# EAGLE design SSLidarboard (EAGLE 9.5.2)

## Sheet 1 of 2
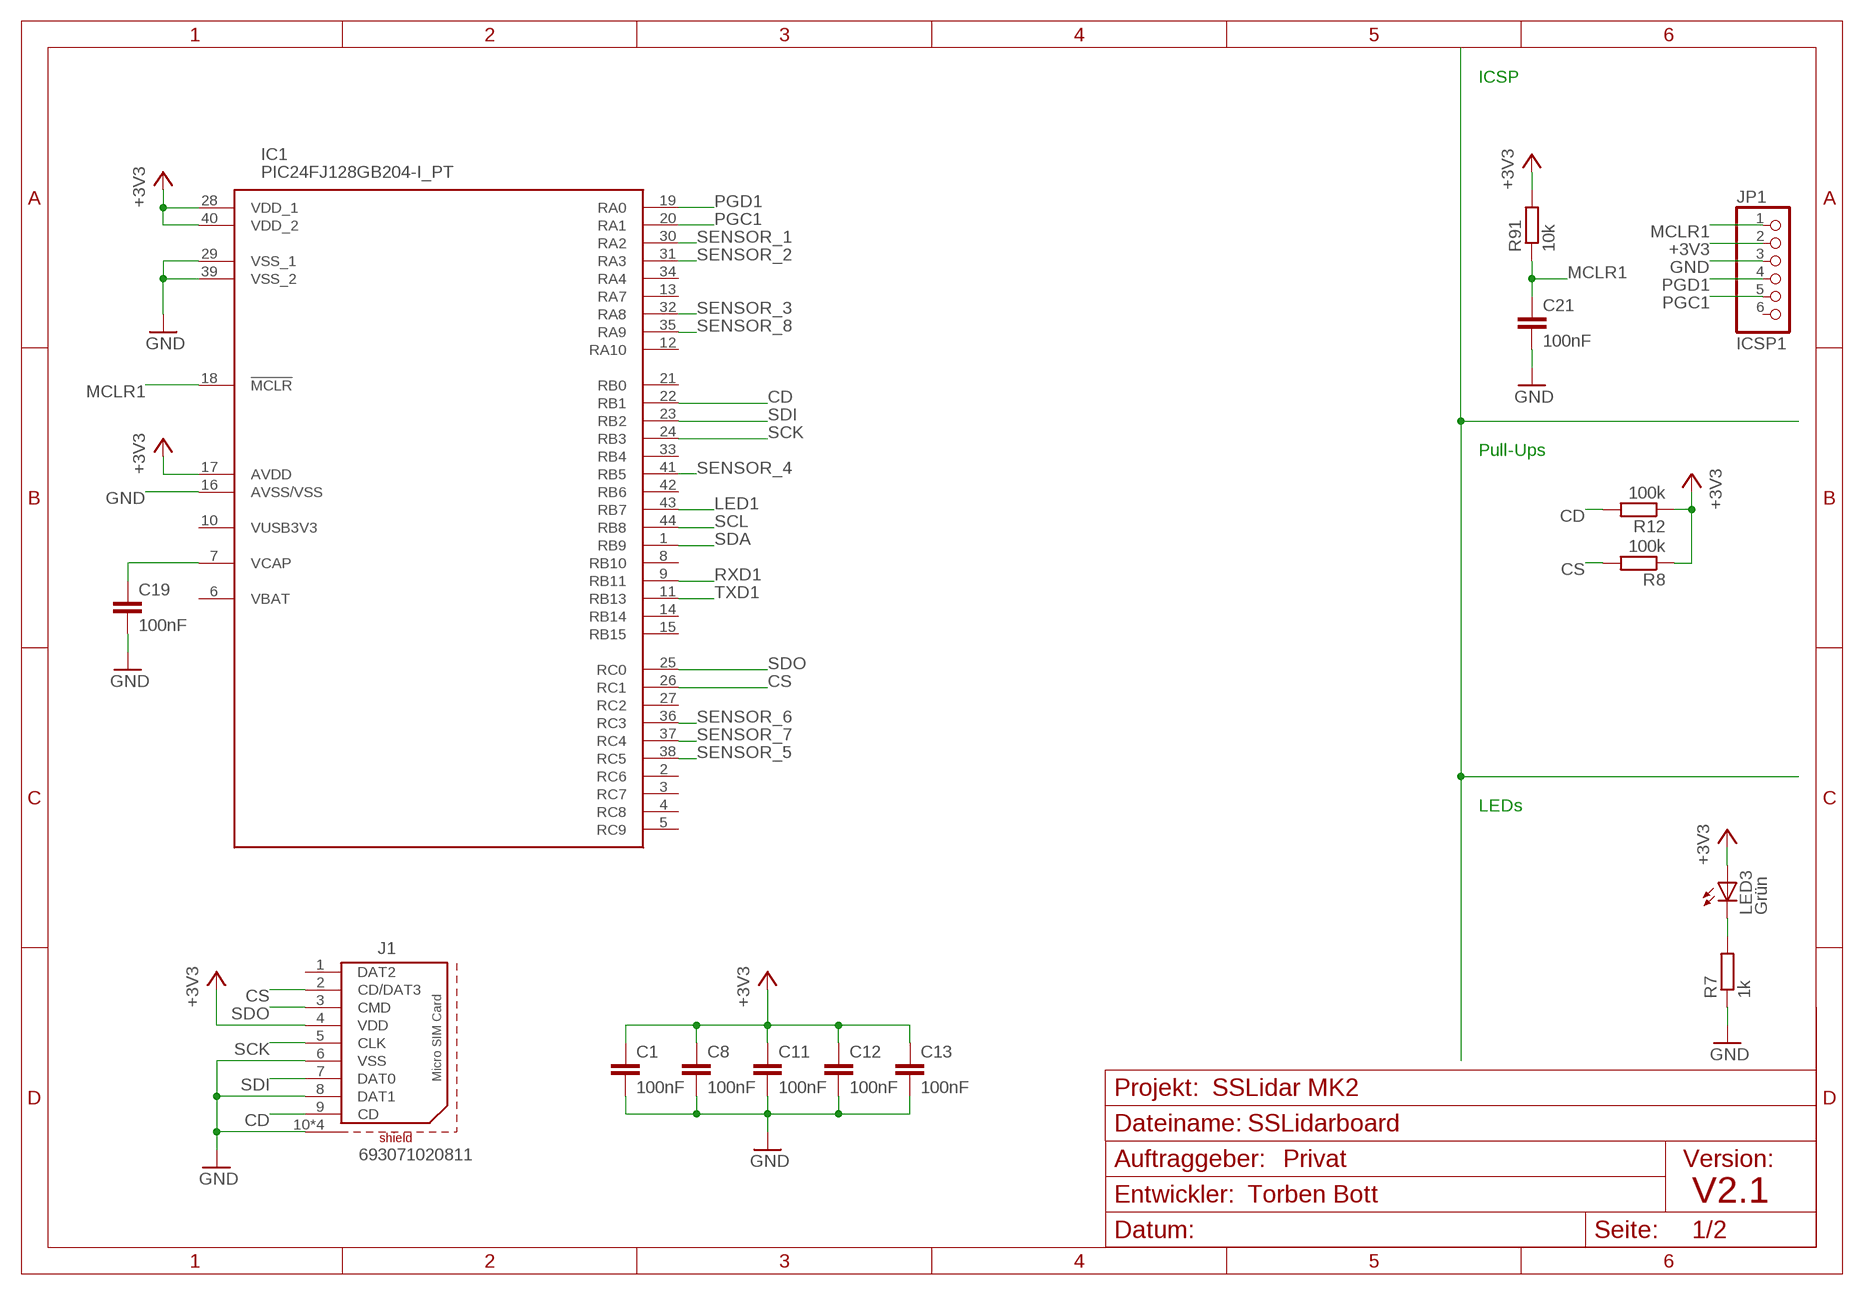
[diagram p0: schematic, sheet 1]

### Parts
C1  100nF  C-EUC0805  [C0805]
C8  100nF  C-EUC0805  [C0805]
C11  100nF  C-EUC0805  [C0805]
C12  100nF  C-EUC0805  [C0805]
C13  100nF  C-EUC0805  [C0805]
C19  100nF  C-EUC0805  [C0805]
C21  100nF  C-EUC0805  [C0805]
IC1  PIC24FJ128GB204-I_PT  [QFP80P1200X1200X120-44N]
J1  693071020811  [693071020811]
JP1  ICSP1  PINHD-1X6  [1X06]
LED3  Grün  LEDCHIPLED_0805  [CHIPLED_0805]
R7  1k  R-EU_R0805  [R0805]
R8  100k  R-EU_R0805  [R0805]
R12  100k  R-EU_R0805  [R0805]
R91  10k  R-EU_R0805  [R0805]

### Nets
+3V3: C1.1 C8.1 C11.1 C12.1 C13.1 IC1.17(AVDD) IC1.28(VDD_1) IC1.40(VDD_2) J1.4(VDD) JP1.2 LED3.A R8.1 R12.1 R91.2 ; also sheet 2
CD: IC1.22(RB1) J1.9(CD) R12.2
CS: IC1.26(RC1) J1.2(CD/DAT3) R8.2
GND: C1.2 C8.2 C11.2 C12.2 C13.2 C19.2 C21.2 IC1.16(AVSS/VSS) IC1.29(VSS_1) IC1.39(VSS_2) J1.6(VSS) J1.8(DAT1) J1.10(SHIELD) J1.11(SHIELD) J1.12(SHIELD) J1.13(SHIELD) JP1.3 R7.1 ; also sheet 2
LED1: IC1.43(RB7)
MCLR1: C21.1 IC1.18(!MCLR) JP1.1 R91.1
N$14: LED3.C R7.2
N$20: C19.1 IC1.7(VCAP)
PGC1: IC1.20(RA1) JP1.5
PGD1: IC1.19(RA0) JP1.4
RXD1: IC1.9(RB11) ; also sheet 2
SCK: IC1.24(RB3) J1.5(CLK)
SCL: IC1.44(RB8) ; also sheet 2
SDA: IC1.1(RB9) ; also sheet 2
SDI: IC1.23(RB2) J1.7(DAT0)
SDO: IC1.25(RC0) J1.3(CMD)
SENSOR_1: IC1.30(RA2) ; also sheet 2
SENSOR_2: IC1.31(RA3) ; also sheet 2
SENSOR_3: IC1.32(RA8) ; also sheet 2
SENSOR_4: IC1.41(RB5) ; also sheet 2
SENSOR_5: IC1.38(RC5) ; also sheet 2
SENSOR_6: IC1.36(RC3) ; also sheet 2
SENSOR_7: IC1.37(RC4) ; also sheet 2
SENSOR_8: IC1.35(RA9) ; also sheet 2
TXD1: IC1.11(RB13) ; also sheet 2
Unconnected: IC1.2(RC6) IC1.3(RC7) IC1.4(RC8) IC1.5(RC9) IC1.6(VBAT) IC1.8(RB10) IC1.10(VUSB3V3) IC1.12(RA10) IC1.13(RA7) IC1.14(RB14) IC1.15(RB15) IC1.21(RB0) IC1.27(RC2) IC1.33(RB4) IC1.34(RA4) IC1.42(RB6) J1.1(DAT2) JP1.6

### Notes on the sheet
- ICSP
- Pull-Ups
- LEDs
- SSLidar MK2
- Privat
- Torben Bott | V2.1

## Sheet 2 of 2
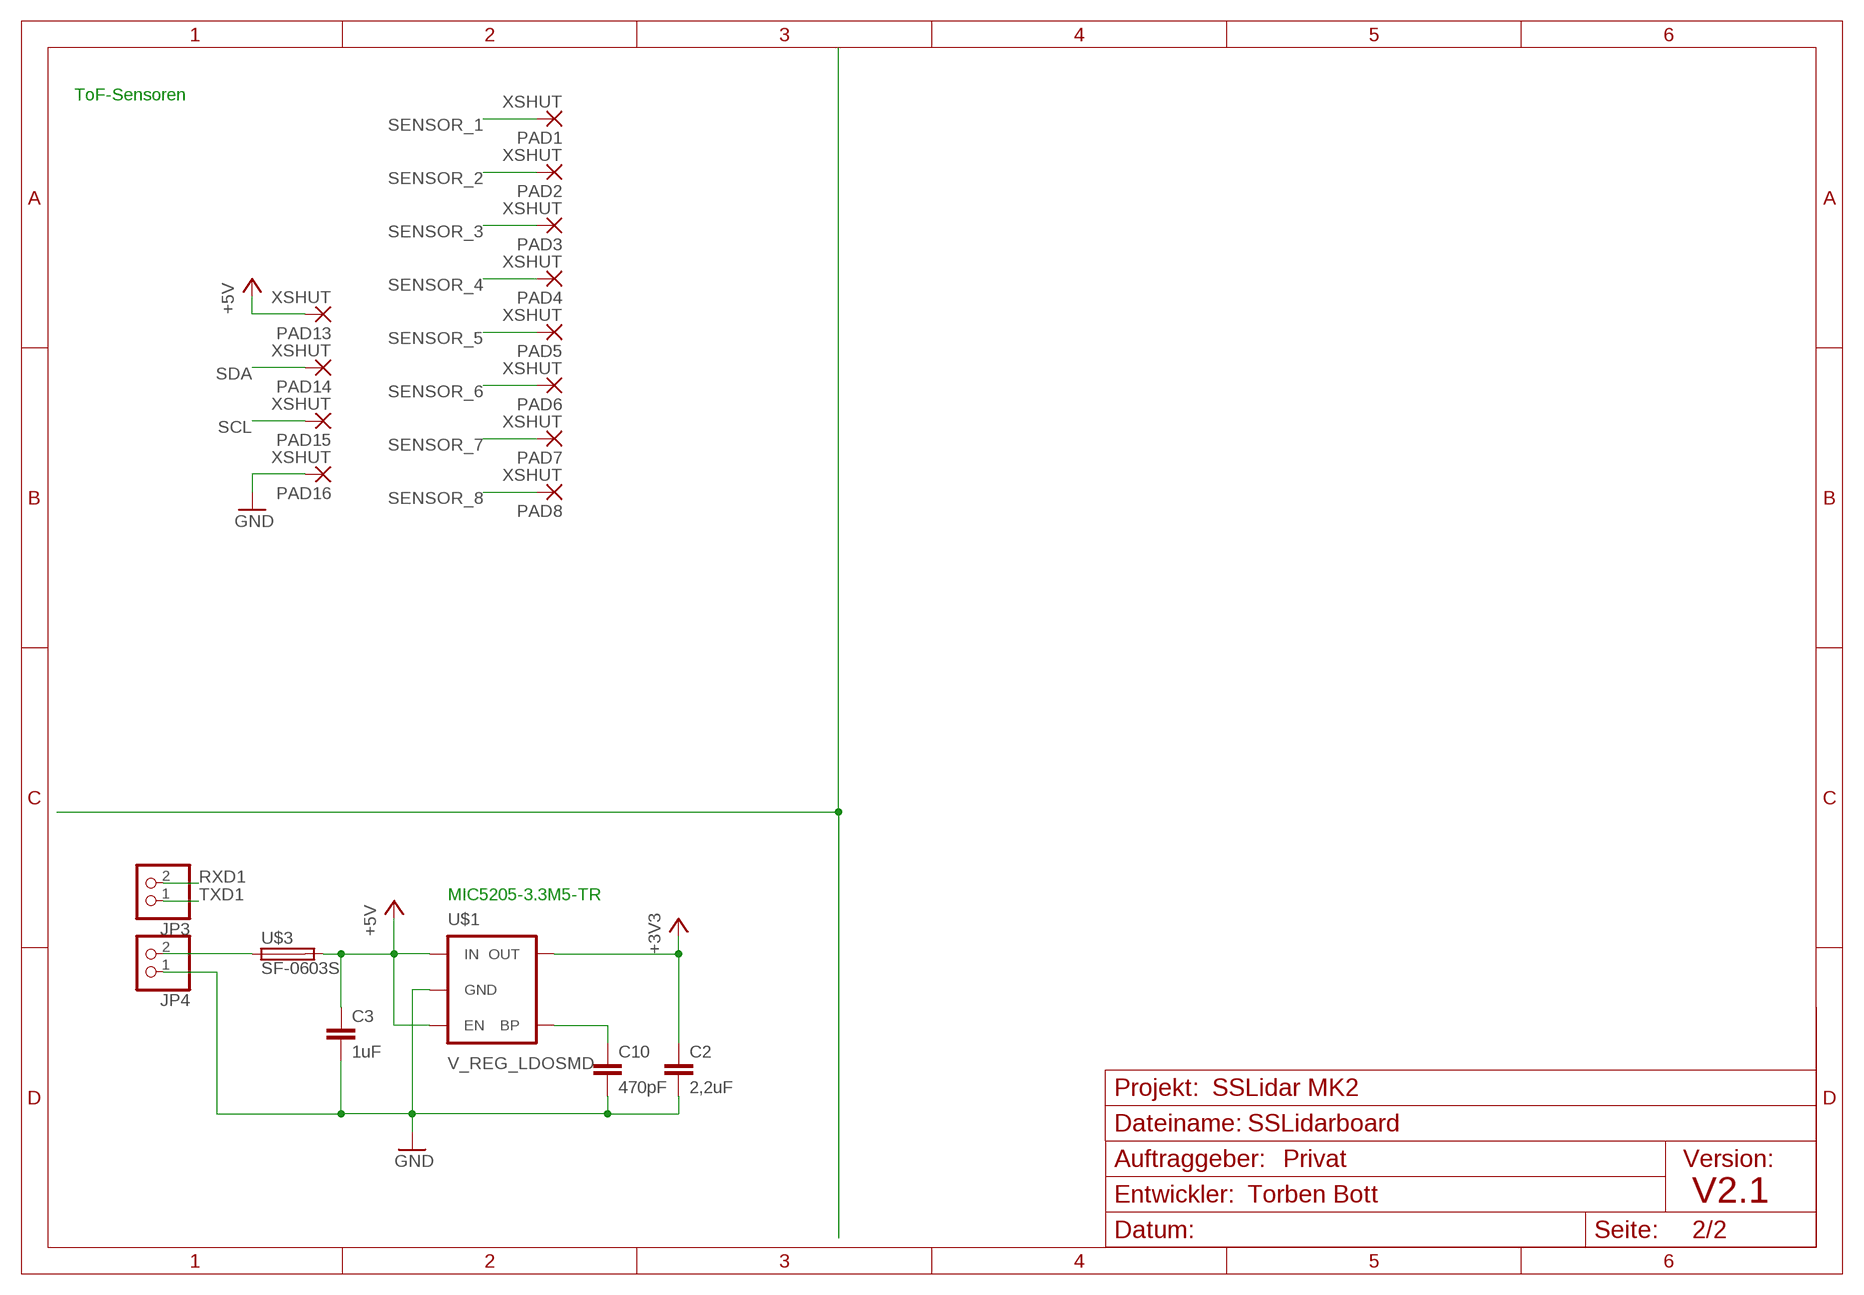
[diagram p1: schematic, sheet 2]

### Parts
C2  2,2uF  C-EUC0805  [C0805]
C3  1uF  C-EUC0805  [C0805]
C10  470pF  C-EUC0805  [C0805]
JP3  PINHD-1X2  [1X02]
JP4  PINHD-1X2  [1X02]
PAD1  XSHUT  WIREPADSMD1,27-254  [SMD1,27-2,54]
PAD2  XSHUT  WIREPADSMD1,27-254  [SMD1,27-2,54]
PAD3  XSHUT  WIREPADSMD1,27-254  [SMD1,27-2,54]
PAD4  XSHUT  WIREPADSMD1,27-254  [SMD1,27-2,54]
PAD5  XSHUT  WIREPADSMD1,27-254  [SMD1,27-2,54]
PAD6  XSHUT  WIREPADSMD1,27-254  [SMD1,27-2,54]
PAD7  XSHUT  WIREPADSMD1,27-254  [SMD1,27-2,54]
PAD8  XSHUT  WIREPADSMD1,27-254  [SMD1,27-2,54]
PAD13  XSHUT  WIREPADSMD1,27-254  [SMD1,27-2,54]
PAD14  XSHUT  WIREPADSMD1,27-254  [SMD1,27-2,54]
PAD15  XSHUT  WIREPADSMD1,27-254  [SMD1,27-2,54]
PAD16  XSHUT  WIREPADSMD1,27-254  [SMD1,27-2,54]
U$1  V_REG_LDOSMD  [SOT23-5]
U$3  SF-0603S  [R0603]

### Nets
+3V3: C2.1 U$1.5(OUT) ; also sheet 1
+5V: C3.1 PAD13.1(P) U$1.1(IN) U$1.3(EN) U$3.2
GND: C2.2 C3.2 C10.2 JP4.1 PAD16.1(P) U$1.2(GND) ; also sheet 1
N$1: JP4.2 U$3.1
N$12: C10.1 U$1.4(BP)
RXD1: JP3.2 ; also sheet 1
SCL: PAD15.1(P) ; also sheet 1
SDA: PAD14.1(P) ; also sheet 1
SENSOR_1: PAD1.1(P) ; also sheet 1
SENSOR_2: PAD2.1(P) ; also sheet 1
SENSOR_3: PAD3.1(P) ; also sheet 1
SENSOR_4: PAD4.1(P) ; also sheet 1
SENSOR_5: PAD5.1(P) ; also sheet 1
SENSOR_6: PAD6.1(P) ; also sheet 1
SENSOR_7: PAD7.1(P) ; also sheet 1
SENSOR_8: PAD8.1(P) ; also sheet 1
TXD1: JP3.1 ; also sheet 1

### Notes on the sheet
- ToF-Sensoren
- MIC5205-3.3M5-TR
- SSLidar MK2
- Privat
- Torben Bott | V2.1

## Library data of the parts
C1-C3 C8 C10-C13 C19 C21 = rcl:C-EU: CAPACITOR, European symbol; SPICEPREFIX: C
IC1 = PIC24FJ128GB204-I_PT:PIC24FJ128GB204-I_PT: PIC24FJ128GB204-I/PT 16bit PIC Microcontroller, 32MHz, 128 kB Flash, 8 kB RAM, 44-Pin TQFP Source: Datasheet <https://componentsearchengine.com/Datasheets/1/PIC24FJ128GB204-I_PT.pdf>; DESCRIPTION: PIC24FJ128GB204-I/PT 16bit PIC Microcontroller, 32MHz, 128 kB Flash, 8 kB RAM, 44-Pin TQFP; HEIGHT: 1.2mm; MANUFACTURER_NAME: Microchip; MANUFACTURER_PART_NUMBER: PIC24FJ128GB204-I/PT; MOUSER_PART_NUMBER: 579-P24FJ128GB204IPT; MOUSER_PRICE-STOCK: https://www.mouser.com/Search/Refine.aspx?Keyword=579-P24FJ128GB204IPT
J1 = 693071020811:693071020811: WR-CRD Micro SD Card Connector Push & Push 8 pins KIND PROPERTIES Quality Class 10 000 Mating cycles Gender Socket Type Push & Push MATERIAL PROPERTIES Insulator Material LCP Insulator Flammability Rating UL94 V-0 Insulator Color Black Color Black Cover Material Stainless Steel Contact Material Copper Alloy Contact Plating Selective Gold;​ 1 u' on contact area Contact Type Stamped GENERAL INFORMATION Operating Temperature -25 up to +85 °C;​ -40 up to +85 °C Compliance RoHS ELECTRICAL PROPERTIES Working Voltage 100 V (AC);​ 30 V (AC) Withstanding Voltage 500 V (AC) Contact Resistance 100 mΩ Contact Resistance 500 mΩ Details see: https://katalog.we-online.com/en/em/CRD_SD_MICRO_PUSH_AND_PULL_8_PINS Created by Ella Wu 2019-11-05 2019(C) Wurth Elektronik; DATASHEET-URL: https://www.we-online.com/catalog/datasheet/693071020811.pdf; GERDER: Socket; IR: 0.5A; MOUNT: SMT; PART-NUMBER: 693071020811; PINS: 8; TYPE: Push & Push; WORKING-VOLTAGE: 30V(AC)
JP1 = pinhead:PINHD-1X6: PIN HEADER
JP3 JP4 = pinhead:PINHD-1X2: PIN HEADER
LED3 = led:LED: LED OSRAM: - CHIPLED LG R971, LG N971, LY N971, LG Q971, LY Q971, LO R971, LY R971 LH N974, LH R974 LS Q976, LO Q976, LY Q976 LO Q996 - Hyper CHIPLED LW Q18S LB Q993, LB Q99A, LB R99A - SideLED LS A670, LO A670, LY A670, LG A670, LP A670 LB A673, LV A673, LT A673, LW A673 LH A674 LY A675 LS A676, LA A676, LO A676, LY A676, LW A676 LS A679, LY A679, LG A679 - Hyper Micro SIDELED® LS Y876, LA Y876, LO Y876, LY Y876 LT Y87S - SmartLED LW L88C, LW L88S LB L89C, LB L89S, LG L890 LS L89K, LO L89K, LY L89K LS L896, LA L896, LO L896, LY L896 - TOPLED LS T670, LO T670, LY T670, LG T670, LP T670 LSG T670, LSP T670, LSY T670, LOP T670, LYG T670 LG T671, LOG T671, LSG T671 LB T673, LV T673, LT T673, LW T673 LH T674 LS T676, LA T676, LO T676, LY T676, LB T676, LH T676, LSB T676, LW T676 LB T67C, LV T67C, LT T67C, LS T67K, LO T67K, LY T67K, LW E67C LS E67B, LA E67B, LO E67B, LY E67B, LB E67C, LV E67C, LT E67C LW T67C LS T679, LY T679, LG T679 LS T770, LO T770, LY T770, LG T770, LP T770 LB T773, LV T773, LT T773, LW T773 LH T774 LS E675, LA E675, LY E675, LS T675 LS T776, LA T776, LO T776, LY T776, LB T776 LHGB T686 LT T68C, LB T68C - Hyper Mini TOPLED® LB M676 - Mini TOPLED Santana® LG M470 LS M47K, LO M47K, LY M47K Source: http://www.osram.convergy.de LUXEON: - LUMILED® LXK2-PW12-R00, LXK2-PW12-S00, LXK2-PW14-U00, LXK2-PW14-V00 LXK2-PM12-R00, LXK2-PM12-S00, LXK2-PM14-U00 LXK2-PE12-Q00, LXK2-PE12-R00, LXK2-PE12-S00, LXK2-PE14-T00, LXK2-PE14-U00 LXK2-PB12-K00, LXK2-PB12-L00, LXK2-PB12-M00, LXK2-PB14-N00, LXK2-PB14-P00, LXK2-PB14-Q00 LXK2-PR12-L00, LXK2-PR12-M00, LXK2-PR14-Q00, LXK2-PR14-R00 LXK2-PD12-Q00, LXK2-PD12-R00, LXK2-PD12-S00 LXK2-PH12-R00, LXK2-PH12-S00 LXK2-PL12-P00, LXK2-PL12-Q00, LXK2-PL12-R00 Source: www.luxeon.com KINGBRIGHT: KA-3528ASYC Source: www.kingbright.com
PAD1-PAD8 PAD13-PAD16 = wirepad:WIREPAD: Wire PAD connect wire on PCB
R7 R8 R12 R91 = rcl:R-EU_: RESISTOR, European symbol; SPICEPREFIX: R
U$1 = SparkFun:V_REG_LDO: Voltage Regulator LDO Standard 150mA LDO voltage regulator in SOT-23 layout. Micrel part MIC5205. BP (by-pass) pin is used to lower output noise with 470pF cap.
U$3 = Eigene Library:SF-0603S; FARNELL: 1652144

## Board
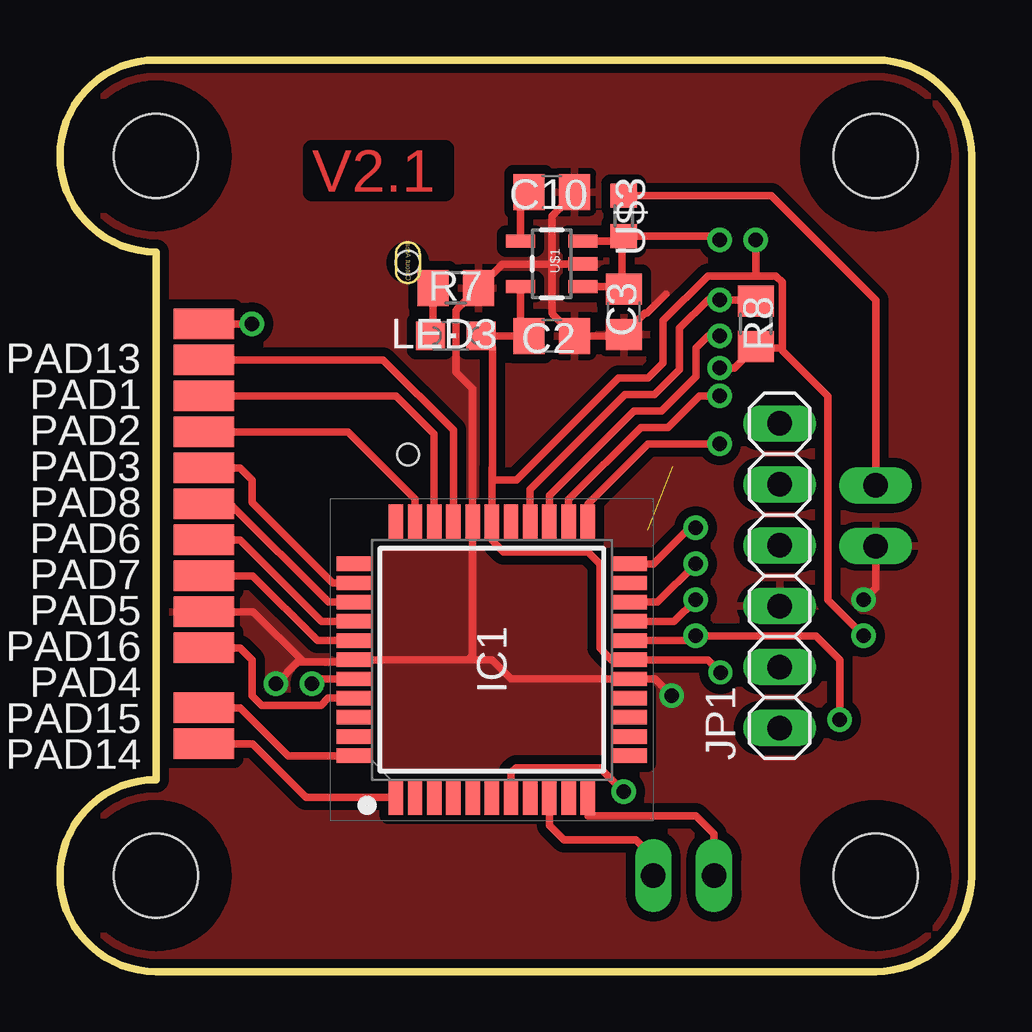
[diagram p2: board, top side]
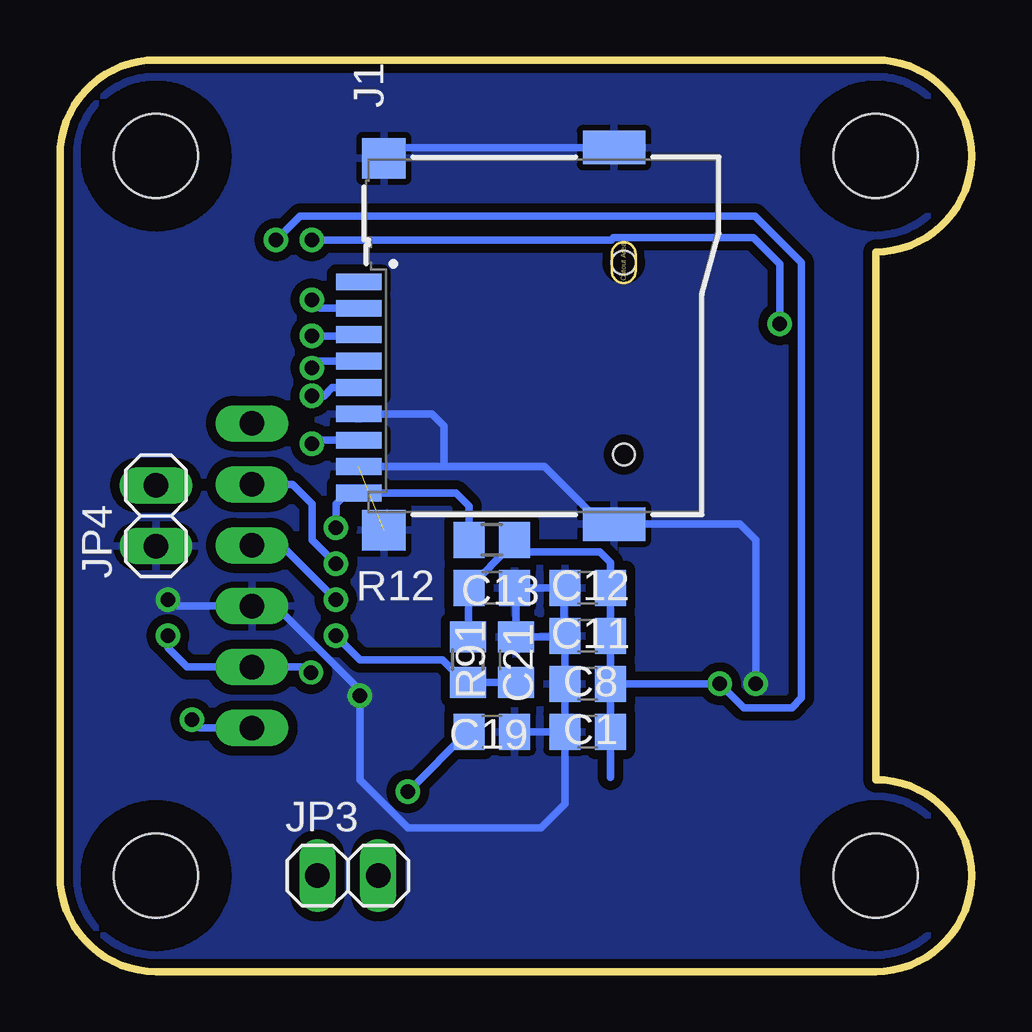
[diagram p3: board, bottom side, seen from below]

Size 38 x 38 mm. Coordinates in mm from the lower left corner, seen from the top.
Outline: 0,34 arc90 4,30 4,8 arc90 0,4 arc90 4,0 34,0 arc90 38,4 38,34 arc90 34,38 4,38 arc90 0,34
Copper layers (1*16): Top 0.035mm / dielectric 1.5mm / Bottom 0.035mm
Design rules "Torben": minimum track width 12mil, minimum drill 0.6mm, track to track 15mil, track to pad 8mil, pad to pad 6mil, via to via 6mil, smd to smd 6mil, copper to edge 15mil, drill to drill 6mil, minimum pad ring 10mil, minimum via ring 8mil, stop-mask expansion 4mil, vias tented up to drill 0mil, thermal gap 10mil
Holes 3.5 mm at 4,34 34,34 34,4 4,4

### Footprints (pad centres in the part's own frame; a part is rotated, then mirrored left to right if it is on the bottom)
C0805 = smd 1.3 x 1.5: 1 -0.95,0; 2 0.95,0
QFP80P1200X1200X120-44N = smd 1.475 x 0.6: 1 -5.738,4; 2 -5.738,3.2; 3 -5.738,2.4; 4 -5.738,1.6; 5 -5.738,0.8; 6 -5.738,0; 7 -5.738,-0.8; 8 -5.738,-1.6; 9 -5.738,-2.4; 10 -5.738,-3.2; 11 -5.738,-4; 23 5.738,-4; 24 5.738,-3.2; 25 5.738,-2.4; 26 5.738,-1.6; 27 5.738,-0.8; 28 5.738,0; 29 5.738,0.8; 30 5.738,1.6; 31 5.738,2.4; 32 5.738,3.2; 33 5.738,4 | smd 0.6 x 1.475: 12 -4,-5.738; 13 -3.2,-5.738; 14 -2.4,-5.738; 15 -1.6,-5.738; 16 -0.8,-5.738; 17 0,-5.738; 18 0.8,-5.738; 19 1.6,-5.738; 20 2.4,-5.738; 21 3.2,-5.738; 22 4,-5.738; 34 4,5.738; 35 3.2,5.738; 36 2.4,5.738; 37 1.6,5.738; 38 0.8,5.738; 39 0,5.738; 40 -0.8,5.738; 41 -1.6,5.738; 42 -2.4,5.738; 43 -3.2,5.738; 44 -4,5.738
693071020811 = smd 0.7 x 1.9: 1 2.25,11.05; 2 1.15,11.05; 3 0.05,11.05; 4 -1.05,11.05; 5 -2.15,11.05; 6 -3.25,11.05; 7 -4.35,11.05; 8 -5.45,11.05; 9 -6.55,11.05 | smd 1.7 x 1.8: 10 -8.1,10; 11 7.4,10 | smd 1.4 x 2.6: 12 -7.85,0.4; 13 7.85,0.4 | hole 0.9: -4.95,0 | hole 1: 3.05,0
1X06 = drill 1.016 long: 1 -6.35,0; 2 -3.81,0; 3 -1.27,0; 4 1.27,0; 5 3.81,0; 6 6.35,0
1X02 = drill 1.016 long: 1 -1.27,0; 2 1.27,0
CHIPLED_0805 = smd 1.2 x 1.2: A 0,-1.05; C 0,1.05
SMD1,27-2,54 = smd 1.27 x 2.54: 1 0,0
R0805 = smd 1.3 x 1.5: 1 -0.95,0; 2 0.95,0
SOT23-5 = smd 0.55 x 1.2: 1 -0.95,-1.3; 2 0,-1.3; 3 0.95,-1.3; 4 0.95,1.3; 5 -0.95,1.3
R0603 = smd 1 x 1.1: 1 -0.85,0; 2 0.85,0

### Placement (x,y rotation side)
C1  16,10 180 bottom
C2  20.5,26.5 0 top
C3  23.5,27.5 270 top
C8  16,12 180 bottom
C10  20.5,32.5 0 top
C11  16,14 180 bottom
C12  16,16 180 bottom
C13  20,16 0 bottom
C19  20,10 0 bottom
C21  19,13 90 bottom
IC1  18,13 90 top
J1  14.5,26.5 90 bottom
JP1  30,16.5 90 top
JP3  26,4 0 bottom
JP4  34,19 90 bottom
LED3  16.5,26.5 90 top
PAD1  6,25.5 90 top
PAD2  6,24 90 top
PAD3  6,22.5 90 top
PAD4  6,13.5 90 top
PAD5  6,16.5 90 top
PAD6  6,19.5 90 top
PAD7  6,18 90 top
PAD8  6,21 270 top
PAD13  6,27 90 top
PAD14  6,9.5 90 top
PAD15  6,11 90 top
PAD16  6,15 90 top
R7  16.5,28.5 180 top
R8  29,27 90 top
R12  20,18 180 bottom
R91  21,13 90 bottom
U$1  20.5,29.5 90 top
U$3  23.5,31.5 270 top

### Tracks (layer width: path | path; a pad name or v marks a point on that pad's centre or on a via)
+3V3  (via drill 0.6)
  Top 0.305: IC1.40 10.7,12.2 v10.5,12 | 30.11,26.11 30,26 29.05,26 R8.1 28.11,25.16 v27.5,25.16 | 29,29 27,29 25.13,27.13 25.13,25.37 24.5,24.74 23.27,24.74 19.03,20.5 18.03,20.5 18.03,21 | 29,29 29.85,29 30.11,28.75 30.11,26.11 | 18.03,21 18,21 IC1.28 18,18 18.14,17.86 18.14,17.85 18.5,17.5 22,17.5 22.5,17 22.5,13.5 22.64,13.36 22.64,13.35 23,13 IC1.17 27,13 v27.54,12.46 | U$1.5 19.2,26.85 C2.1 LED3.A 18.03,26.02 18.03,21 | v33.5,14 32,15.5 32,24 30.11,25.89 30.11,26.11 | v29,30.5 29,29
  Bottom 0.305: R91.2 20.98,13.97 | 20.98,13.97 20.95,14 | C12.1 C11.1 C8.1 | C8.1 C1.1 | C13.1 20.98,15.98 | 20.98,15.98 20.98,13.97 | 21,16 20.98,15.98 | C8.1 v10.5,12 9.5,11 7.5,11 7.09,11.41 7.09,29.56 9.03,31.5 28,31.5 v29,30.5 | 21,16.05 C13.1 | 15,9.95 C1.1 | C12.1 15.05,16.1 | J1.4 27.21,25.45 v27.5,25.16 | C13.1 20.06,16.89 20.06,16.9 19.05,17.9 R12.1 18.55,17.5 15.5,17.5 15.05,17.05 C12.1 | C1.1 15.05,8.1 | v27.54,12.46 27.5,12.5 27.69,12.69 JP1.2 32.69,12.69 33.5,13.5 v33.5,14
+5V  (via drill 0.6)
  Top 0.305: U$1.1 23.4,28.55 C3.1 23.43,28.52 23.43,30.58 | U$1.3 23.3,30.45 23.43,30.58 | 23.43,30.58 U$3.2 27.35,30.65 v27.5,30.5 | v8,27 PAD13.1
  Bottom 0.305: v8,27 8,29.5 9.08,30.58 14.93,30.58 15.01,30.5 v27.5,30.5
CD  (via drill 0.6)
  Top 0.305: v26.5,18.5 26.24,18.5 24.74,17 IC1.22
  Bottom 0.305: J1.9 25.5,20 25,20 | J1.9 26.05,19.95 26.5,19.5 v26.5,18.5 | J1.9 21.5,19.95 20.95,19.4 R12.2
CS  (via drill 0.6)
  Top 0.305: R8.2 28.95,28 v27.5,28 27,28 25.81,26.81 25.81,25.09 24.78,24.06 23.56,24.06 19.6,20.1 IC1.26
  Bottom 0.305: J1.2 27.15,27.65 v27.5,28
GND  (via drill 0.6)  (1 unrouted)
  Top 0.305: v25.5,11.5 24.8,12.2 IC1.16 18.8,12.2 18,13 17,13 | 10.15,12.91 12.17,12.91 IC1.39 17,13 | C10.2 21.45,32.45 20.5,31.5 20.5,29.5 | 20.5,29.5 20.5,27.45 20.56,27.4 20.56,27.39 C2.2 23.45,26.5 C3.2 24.39,27.44 24.48,27.44 25.27,28.23 | U$1.2 20.5,29.5 | 20.5,29.5 18.45,29.5 R7.1 16.56,27.61 16.56,27.6 16.5,27.55 16.5,25 17.2,24.3 IC1.29 17.2,13.2 17,13 | JP4.1 34,16 v33.5,15.5 | 7,15 PAD16.1 8.06,15 10.15,12.91 | 10.15,12.91 9.91,12.91 v9,12
  Bottom 0.305: 17,11.95 C8.2 | C1.2 C8.2 | C8.2 C11.2 | 17,16 C12.2 | C11.2 17,14.05 17,16 | 17,16 C13.2 19,15.95 C21.2 17,13.95 C11.2 | C19.2 C1.2 | C1.2 16.95,7 17.95,6 23.5,6 25.5,8 v25.5,11.5 25.5,11.71 29.02,15.23 JP1.3 33.23,15.23 v33.5,15.5 | J1.6 22.5,23.25 22,22.75 22,21.05 | J1.8 22,21.05 | 22,21.05 17.8,21.05 15.4,18.65 J1.12 9.65,18.65 9,18 v9,12 | J1.13 24.05,34.35 J1.11
  pour Bottom: 4,8 arc90 0,4 arc90 4,0 34,0 arc90 38,4 38,34 arc90 34,38 4,38 arc90 0,34 arc90 4,30
  pour Top: 4,8 arc90 0,4 arc90 4,0 34,0 arc90 38,4 38,34 arc90 34,38 4,38 arc90 0,34 arc90 4,30
  cutout Top: 4,37 arc90 1,34 arc90 4,31 arc90 7,34 arc90
  cutout Bottom: 4,37 arc90 1,34 arc90 4,31 arc90 7,34 arc90
GND2
  cutout Top: 34,37 arc90 31,34 arc90 34,31 arc90 37,34 arc90
  cutout Bottom: 34,37 arc90 31,34 arc90 34,31 arc90 37,34 arc90
GND3
  cutout Top: 34,7 arc90 31,4 arc90 34,1 arc90 37,4 arc90
  cutout Bottom: 34,7 arc90 31,4 arc90 34,1 arc90 37,4 arc90
GND4
  cutout Top: 4,7 arc90 1,4 arc90 4,1 arc90 7,4 arc90
  cutout Bottom: 4,7 arc90 1,4 arc90 4,1 arc90 7,4 arc90
MCLR1  (via drill 0.6)
  Top 0.305: IC1.18 26.3,13.8 v26.5,14 31.5,14 32.5,13 v32.5,10.5
  Bottom 0.305: C21.1 R91.1 21.1,12.05 22.05,13 25.5,13 v26.5,14 | JP1.1 32.15,10.15 v32.5,10.5
N$1
  Top 0.305: U$3.1 29.65,32.35 34,28 JP4.2
N$12
  Top 0.305: U$1.4 19.2,32.15 C10.1
N$14
  Top 0.305: LED3.C 15.55,26.6 R7.2
N$20  (via drill 0.6)
  Top 0.305: IC1.7 18.8,8.3 19,8.5 22.5,8.5 v23.5,7.5
  Bottom 0.305: v23.5,7.5 20.95,10.05 C19.1
PGC1  (via drill 0.6)
  Top 0.305: IC1.20 24.9,15.4 v26.5,17
  Bottom 0.305: v26.5,17 27.5,18 27.5,19.5 28.31,20.31 JP1.5
PGD1  (via drill 0.6)
  Top 0.305: IC1.19 25.6,14.6 v26.5,15.5
  Bottom 0.305: v26.5,15.5 28.77,17.77 JP1.4
RXD1
  Top 0.305: IC1.9 20.4,6.1 21,5.5 24,5.5 24.5,5 24.5,4.23 JP3.2
SCK  (via drill 0.6)
  Top 0.305: IC1.24 21.2,19.67 24.22,22.69 25.35,22.69 26.67,24 v27.5,24
  Bottom 0.305: J1.5 26.65,24.35 27,24 v27.5,24
SCL
  Top 0.305: PAD15.1 7.5,11 9.25,9.25 9.5,9 IC1.44
SDA
  Top 0.305: IC1.1 10.27,7.26 8.03,9.5 PAD14.1
SDI  (via drill 0.6)
  Top 0.305: IC1.23 22,19.5 24.5,22 v27.5,22
  Bottom 0.305: J1.7 27.35,22.15 v27.5,22
SDO  (via drill 0.6)
  Top 0.305: IC1.25 20.4,19.84 23.93,23.37 25.07,23.37 26.5,24.8 26.5,26 27,26.5 v27.5,26.5
  Bottom 0.305: J1.3 25.6,26.5 v27.5,26.5
SENSOR_1
  Top 0.305: 7,25.5 PAD1.1 13.47,25.5 16.4,22.57 IC1.30
SENSOR_2
  Top 0.305: 6.97,24 PAD2.1 14,24 15.6,22.4 IC1.31
SENSOR_3
  Top 0.305: IC1.32 14.8,19.7 12,22.5 PAD3.1
SENSOR_4
  Top 0.305: IC1.41 11.19,11.4 10.88,11.09 8.41,11.09 8,11.5 8,13 7.5,13.5 PAD4.1
SENSOR_5
  Top 0.305: PAD5.1 8.03,16.5 10.73,13.8 IC1.38
SENSOR_6
  Top 0.305: PAD6.1 7.09,19.5 11.19,15.4 IC1.36
SENSOR_7
  Top 0.305: IC1.37 10.9,14.6 7.5,18 PAD7.1
SENSOR_8
  Top 0.305: IC1.35 11.36,16.2 8,19.56 8,20.5 7.5,21 PAD8.1
TXD1
  Top 0.305: IC1.11 22,6.5 26.5,6.5 27.27,5.73 JP3.1

### Text on the board
Top: V2.1